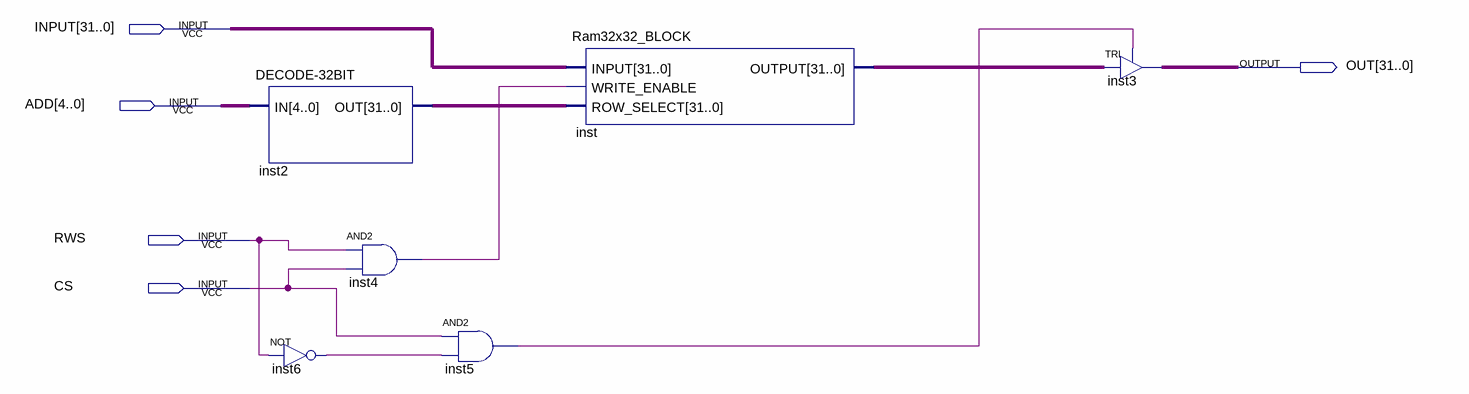
[diagram p0: schematic sheet]
// Quartus schematic Ram32x32.bdf as structural Verilog: 6 symbols, 5 pins
module Ram32x32 (
  input  [31:0] INPUT,
  input  [4:0] ADD,
  input  RWS,
  input  CS,
  output [31:0] OUT
);

  wire inst4_out, inst5_out, inst6_out;
  wire [31:0] inst2_out, inst_output;

  \DECODE-32BIT  inst2 (.IN(ADD), .OUT(inst2_out));
  not inst6 (inst6_out, RWS);
  and inst4 (inst4_out, RWS, CS);
  and inst5 (inst5_out, CS, inst6_out);
  Ram32x32_BLOCK inst (.INPUT(INPUT), .WRITE_ENABLE(inst4_out), .ROW_SELECT(inst2_out), .OUTPUT(inst_output));
  TRI inst3[31:0] (.IN(inst_output), .OE(inst5_out), .OUT(OUT));
endmodule
